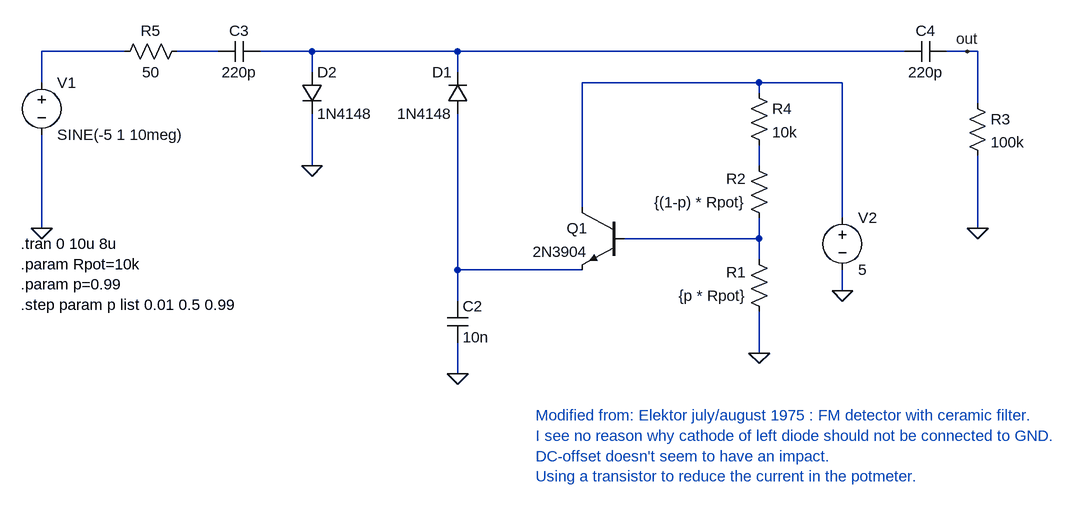
[diagram p0: schematic 2_diode_limiter.asc]
2_diode_limiter.asc, the LTspice schematic file:
Version 4
SHEET 1 1096 756
WIRE -416 96 -544 96
WIRE -272 96 -336 96
WIRE -128 96 -208 96
WIRE 96 96 -128 96
WIRE 784 96 96 96
WIRE 880 96 848 96
WIRE 896 96 880 96
WIRE -128 128 -128 96
WIRE 96 128 96 96
WIRE -544 144 -544 96
WIRE 560 144 288 144
WIRE 688 144 560 144
WIRE 560 160 560 144
WIRE 896 176 896 96
WIRE -128 272 -128 192
WIRE 560 272 560 240
WIRE 288 336 288 144
WIRE 688 352 688 144
WIRE -544 368 -544 224
WIRE 896 368 896 256
WIRE 560 384 560 352
WIRE 560 384 352 384
WIRE 560 416 560 384
WIRE 96 432 96 192
WIRE 288 432 96 432
WIRE 688 464 688 432
WIRE 96 480 96 432
WIRE 560 560 560 496
WIRE 96 592 96 544
FLAG -544 368 0
FLAG -128 272 0
FLAG 96 592 0
FLAG 896 368 0
FLAG 688 464 0
FLAG 880 96 out
FLAG 560 560 0
SYMBOL diode 112 192 R180
WINDOW 0 24 64 Left 2
WINDOW 3 24 0 Left 2
SYMATTR InstName D1
SYMATTR Value 1N4148
SYMBOL diode -144 128 R0
SYMATTR InstName D2
SYMATTR Value 1N4148
SYMBOL res 576 512 R180
WINDOW 0 36 76 Left 2
WINDOW 3 36 40 Left 2
SYMATTR InstName R1
SYMATTR Value {p * Rpot}
SYMBOL cap 80 480 R0
SYMATTR InstName C2
SYMATTR Value 10n
SYMBOL cap -208 80 R90
WINDOW 0 0 32 VBottom 2
WINDOW 3 32 32 VTop 2
SYMATTR InstName C3
SYMATTR Value 220p
SYMBOL cap 848 80 R90
WINDOW 0 0 32 VBottom 2
WINDOW 3 32 32 VTop 2
SYMATTR InstName C4
SYMATTR Value 220p
SYMBOL res 880 160 R0
SYMATTR InstName R3
SYMATTR Value 100k
SYMBOL voltage -544 128 R0
WINDOW 123 0 0 Left 0
WINDOW 39 0 0 Left 0
SYMATTR InstName V1
SYMATTR Value SINE(-5 1 10meg)
SYMBOL voltage 688 336 R0
SYMATTR InstName V2
SYMATTR Value 5
SYMBOL res -320 80 R90
WINDOW 0 0 56 VBottom 2
WINDOW 3 32 56 VTop 2
SYMATTR InstName R5
SYMATTR Value 50
SYMBOL res 576 368 R180
WINDOW 0 36 76 Left 2
WINDOW 3 36 40 Left 2
SYMATTR InstName R2
SYMATTR Value {(1-p) * Rpot}
SYMBOL npn 352 336 M0
SYMATTR InstName Q1
SYMATTR Value 2N3904
SYMBOL res 544 144 R0
SYMATTR InstName R4
SYMATTR Value 10k
TEXT -576 392 Left 2 !.tran 0 10u 8u\n.param Rpot=10k\n.param p=0.99\n.step param p list 0.01 0.5 0.99
TEXT 216 656 Left 2 ;Modified from: Elektor july/august 1975 : FM detector with ceramic filter.\nI see no reason why cathode of left diode should not be connected to GND.  \nDC-offset doesn't seem to have an impact.\nUsing a transistor to reduce the current in the potmeter.

The netlist it stands for:
* 2_diode_limiter.asc
D1 N007 N003 1N4148
D2 N003 0 1N4148
R1 0 N006 {p * Rpot}
C2 N007 0 10n
C3 N003 N002 220p
C4 out N003 220p
R3 out 0 100k
V1 N001 0 SINE(-5 1 10meg)
V2 N004 0 5
R5 N002 N001 50
R2 N006 N005 {(1-p) * Rpot}
Q1 N004 N006 N007 0 2N3904
R4 N004 N005 10k
.model D D
.lib standard.dio
.model NPN NPN
.model PNP PNP
.lib standard.bjt
.tran 0 10u 8u
.param Rpot=10k
.param p=0.99
.step param p list 0.01 0.5 0.99
* Modified from: Elektor july/august 1975 : FM detector with ceramic filter.
* I see no reason why cathode of left diode should not be connected to GND.
* DC-offset doesn't seem to have an impact.
* Using a transistor to reduce the current in the potmeter.
.backanno
.end